# Altium schematic sheet CONN.schdoc: TITRE
size Letter; ApprovedBy: APPROUVÉ PAR; Organization: Cegep Limoilou; Address1: 1300, 8e Avenue; Address2: Québec, QC; Address3: Canada; Address4: G1J 5L5; SheetNumber: 2; SheetTotal: 6
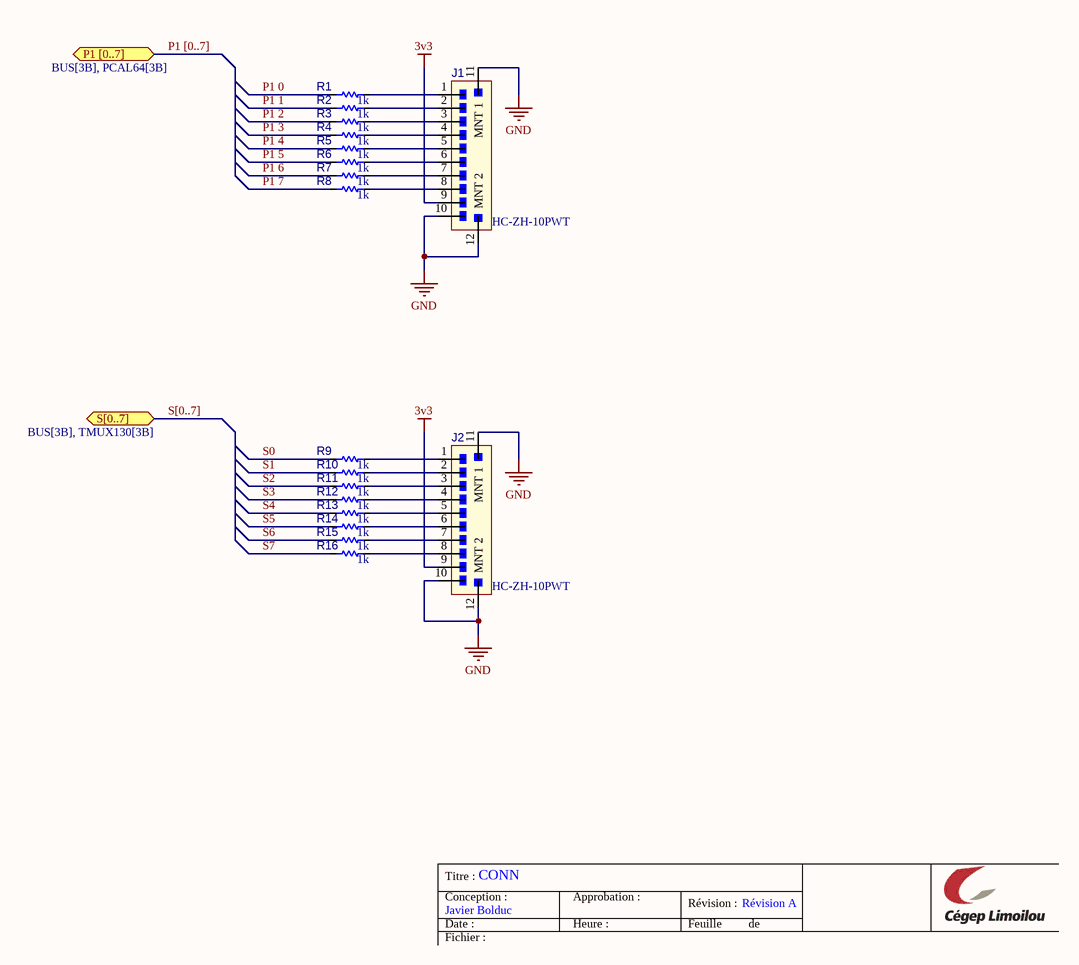
[diagram p0: CONN.schdoc]

## Parts
J1  HC-ZH-10PWT  [J_S10B-ZR-SM4]
J2  HC-ZH-10PWT  [J_S10B-ZR-SM4]
R1  value 1k  [R_1608[0603]]  (hidden comment: Res 1k 1% 0603)
R2  value 1k  [R_1608[0603]]  (hidden comment: Res 1k 1% 0603)
R3  value 1k  [R_1608[0603]]  (hidden comment: Res 1k 1% 0603)
R4  value 1k  [R_1608[0603]]  (hidden comment: Res 1k 1% 0603)
R5  value 1k  [R_1608[0603]]  (hidden comment: Res 1k 1% 0603)
R6  value 1k  [R_1608[0603]]  (hidden comment: Res 1k 1% 0603)
R7  value 1k  [R_1608[0603]]  (hidden comment: Res 1k 1% 0603)
R8  value 1k  [R_1608[0603]]  (hidden comment: Res 1k 1% 0603)
R9  value 1k  [R_1608[0603]]  (hidden comment: Res 1k 1% 0603)
R10  value 1k  [R_1608[0603]]  (hidden comment: Res 1k 1% 0603)
R11  value 1k  [R_1608[0603]]  (hidden comment: Res 1k 1% 0603)
R12  value 1k  [R_1608[0603]]  (hidden comment: Res 1k 1% 0603)
R13  value 1k  [R_1608[0603]]  (hidden comment: Res 1k 1% 0603)
R14  value 1k  [R_1608[0603]]  (hidden comment: Res 1k 1% 0603)
R15  value 1k  [R_1608[0603]]  (hidden comment: Res 1k 1% 0603)
R16  value 1k  [R_1608[0603]]  (hidden comment: Res 1k 1% 0603)

## Ports
P1 [0..7] (bidir, see BUS[3B], PCAL64[3B]), S[0..7] (bidir, see BUS[3B], TMUX130[3B])

## Nets
3v3: J1.9 J2.9
GND: J1.10 J1.11(MNT_1) J1.12(MNT_2) J2.10 J2.11(MNT_1) J2.12(MNT_2)
P1 0: R1.2
P1 1: R2.2
P1 2: R3.2
P1 3: R4.2
P1 4: R5.2
P1 5: R6.2
P1 6: R7.2
P1 7: R8.2
S0: R9.2
S1: R10.2
S2: R11.2
S3: R12.2
S4: R13.2
S5: R14.2
S6: R15.2
S7: R16.2
NetJ1_1: J1.1 R1.1
NetJ1_2: J1.2 R2.1
NetJ1_3: J1.3 R3.1
NetJ1_4: J1.4 R4.1
NetJ1_5: J1.5 R5.1
NetJ1_6: J1.6 R6.1
NetJ1_7: J1.7 R7.1
NetJ1_8: J1.8 R8.1
NetJ2_1: J2.1 R9.1
NetJ2_2: J2.2 R10.1
NetJ2_3: J2.3 R11.1
NetJ2_4: J2.4 R12.1
NetJ2_5: J2.5 R13.1
NetJ2_6: J2.6 R14.1
NetJ2_7: J2.7 R15.1
NetJ2_8: J2.8 R16.1

## Buses and harness runs
bus P1 [0..7] = port P1 [0..7]
bus S[0..7] = port S[0..7]

## Notes on the sheet
- Titre :
- Conception :
- Date :
- Javier Bolduc
- CONN
- Approbation :
- Heure :
- Révision :
- Feuille
- Révision A
- de
- Fichier :

## Library data of the parts
J1 J2 = CONN-1MM5-01X10-S10B-H-SMT: CONN wire to board SMT R/A 10POS 1.5mm; Manufacturer 1: HCTL; Manufacturer Part Number 1: HC-ZH-10PWT; Manufacturer 2: JST; Manufacturer Part Number 2: S10B-ZR-SM4A-TF(LF)(SN); Mounting Technology: SMT; Supplier 1: LCSC; Supplier 2: LCSC; Supplier Part Number 1: C2845432; Supplier Part Number 2: C5149249; Supplier 3: Digikey; Supplier Part Number 3: 455-1700-1-ND
R1-R16 = RES015: Resistor type 1; Manufacturer 1: Yageo; Manufacturer Part Number 1: RC0603FR-071KL; LibRef: RES015; Puissance: 1/10W; Max Working Voltage: 75V; Tolerance: 1%; Mounting Technology: SMT; Supplier 1: LCSC; Supplier Part Number 1: C22548